# Altium schematic sheet led-driver.SchDoc
size A
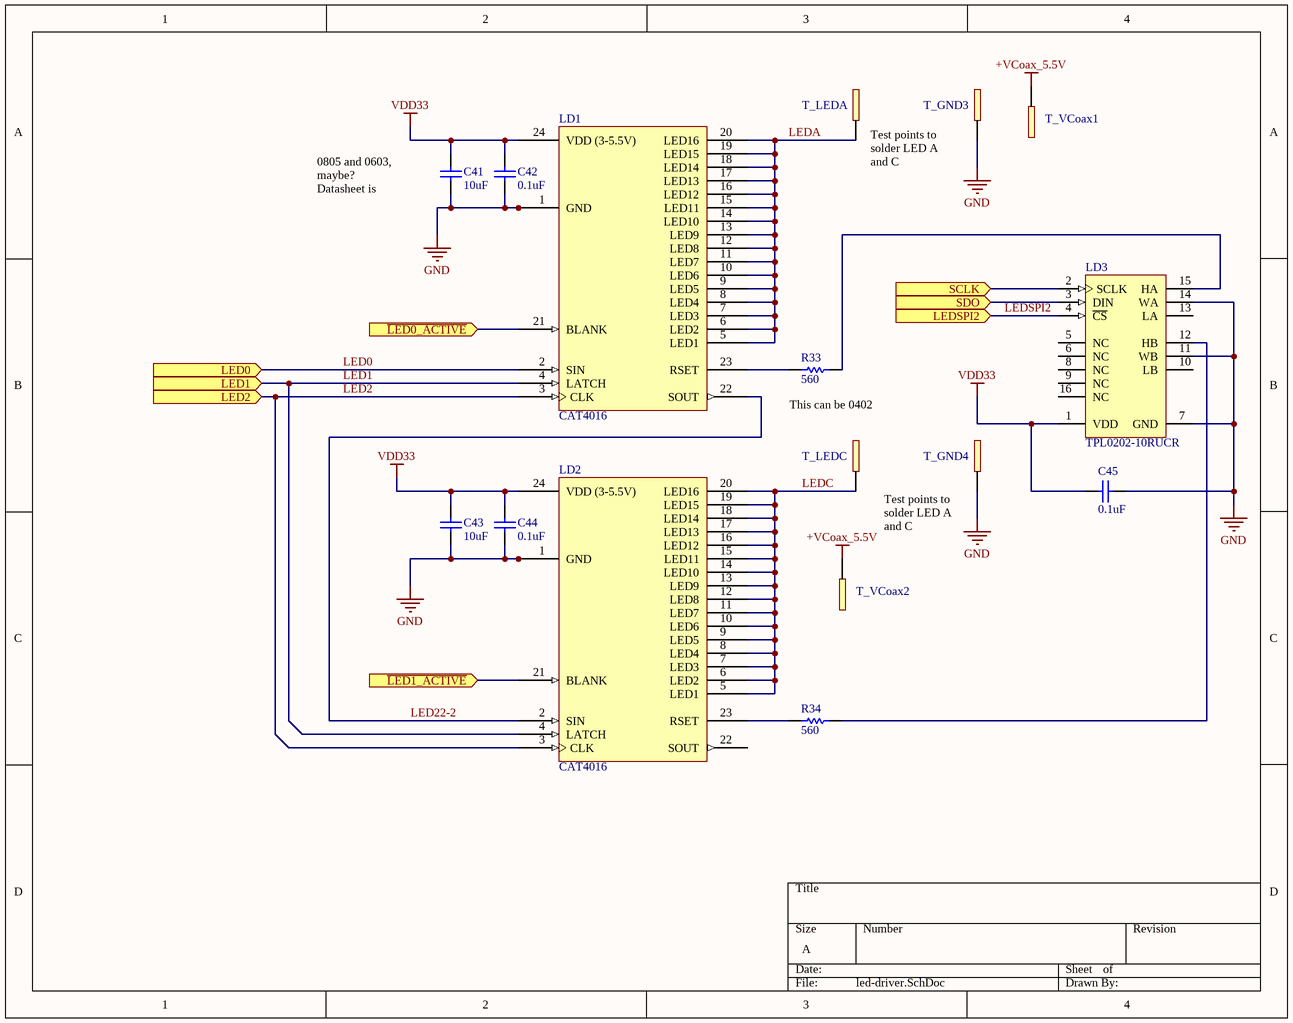
[diagram p0: led-driver.SchDoc]

## Parts
C41  value 10uF  [Cap-0603]  (hidden comment: Cap)
C42  value 0.1uF  [Cap_0402]  (hidden comment: Cap)
C43  value 10uF  [Cap-0603]  (hidden comment: Cap)
C44  value 0.1uF  [Cap_0402]  (hidden comment: Cap)
C45  value 0.1uF  [Cap_0402]  (hidden comment: Cap)
LD1  CAT4016  [TQFN24-4x4mm]
LD2  CAT4016  [TQFN24-4x4mm]
LD3  TPL0202-10RUCR  [WQFN16-3X3mm]
R33  value 560  [Res_0402]  (hidden comment: Res1)
R34  value 560  [Res_0402]  (hidden comment: Res1)
T_GND3  Header_1PIN  [JUMPER1PIN]  (value not drawn)
T_GND4  Header_1PIN  [JUMPER1PIN]  (value not drawn)
T_LEDA  Header_1PIN  [JUMPER1PIN]  (value not drawn)
T_LEDC  Header_1PIN  [JUMPER1PIN]  (value not drawn)
T_VCoax1  Header_1PIN  [JUMPER1PIN]  (value not drawn)
T_VCoax2  Header_1PIN  [JUMPER1PIN]  (value not drawn)

## Ports
LED0 (in), LED1 (in), LED2 (in), LEDSPI2 (in), SCLK (in), SDO (in), ~{LED0_ACTIVE} (in), ~{LED1_ACTIVE} (in)

## Nets
+VCoax_5.5V: T_VCoax1.0 T_VCoax2.0
GND: C41.1 C42.1 C43.1 C44.1 C45.2 LD1.1(GND) LD1.PAD LD2.1(GND) LD2.PAD LD3.7(GND) LD3.11(WB) LD3.14(WA) T_GND3.0 T_GND4.0
VDD33: C41.2 C42.2 C43.2 C44.2 C45.1 LD1.24(VDD_(3-5.5V)) LD2.24(VDD_(3-5.5V)) LD3.1(VDD)
~{LED0_ACTIVE}: LD1.21(BLANK) ; port ~{LED0_ACTIVE}
~{LED1_ACTIVE}: LD2.21(BLANK) ; port ~{LED1_ACTIVE}
LED0: LD1.2(SIN) ; port LED0
LED1: LD1.4(LATCH) LD2.4(LATCH) ; port LED1
LED2: LD1.3(CLK) LD2.3(CLK) ; port LED2
LED22-2: LD1.22(SOUT) LD2.2(SIN)
LEDA: LD1.5(LED1) LD1.6(LED2) LD1.7(LED3) LD1.8(LED4) LD1.9(LED5) LD1.10(LED6) LD1.11(LED7) LD1.12(LED8) LD1.13(LED9) LD1.14(LED10) LD1.15(LED11) LD1.16(LED12) LD1.17(LED13) LD1.18(LED14) LD1.19(LED15) LD1.20(LED16) T_LEDA.0
LEDC: LD2.5(LED1) LD2.6(LED2) LD2.7(LED3) LD2.8(LED4) LD2.9(LED5) LD2.10(LED6) LD2.11(LED7) LD2.12(LED8) LD2.13(LED9) LD2.14(LED10) LD2.15(LED11) LD2.16(LED12) LD2.17(LED13) LD2.18(LED14) LD2.19(LED15) LD2.20(LED16) T_LEDC.0
LEDSPI2: LD3.4(~{CS}) ; port LEDSPI2
SCLK: LD3.2(SCLK) ; port SCLK
SDO: LD3.3(DIN) ; port SDO
NetLD1_23: LD1.23(RSET) R33.2
NetLD2_23: LD2.23(RSET) R34.2
NetLD3_12: LD3.12(HB) R34.1
NetLD3_15: LD3.15(HA) R33.1

Not connected (* = marked no-connect by the designer): LD2 22(SOUT); LD3 5(NC) 6(NC) 8(NC) 9(NC) 10(LB) 13(LA) 16(NC)

## Notes on the sheet
- Test points to solder LED A and C
- (near C41) 0805 and 0603, maybe? Datasheet is lacking...
- (near R33) This can be 0402

## Library data of the parts
C41-C45 = Cap: Capacitor; Published: 8-Jun-2000; LatestRevisionDate: 17-Jul-2002; LatestRevisionNote: Re-released for DXP Platform.; PackageReference: RAD-0.3; Publisher: Altium Limited; PackageDescription: Radial Cap, Thru-Hole; 2 Leads; 0.3 in Pin Spacing
LD1 LD2 = CAT4016: 16-Channel Constant Current LED Driver
LD3 = TPL0202-10RUCR: 256 Tap, Dual Channel Digital Potentiometer with SPI Interface and Non-Volatile Memory, -40 to 85 degC, 14-pin QFN (RUC14); Manufacturer: Texas Instruments; DAC Channels: 2; DNL(Max)(+/-LSB): 0.5; INL(Max)(+/-LSB): 1; DatasheetVersion: SLIS135C; PackageVersion: 4208447/C, 08/2008; PackageReference: RUC14; PackageDescription: 14-Pin Plastic Quad Flatpack No-Lead, Body 2 x 2 mm, Pitch 0.4 mm; Supplier 1: Mouser; Supplier Part Number 1: N/A; Interface: SPI; SubFamily: Digital Potentiometer; Mounting Technology: Surface Mount; Code_JEDEC: MO-288; PartNumber: TPL0202-10RUCR; ComponentLink1Description: Manufacturer URL; ComponentLink1URL: http://www.ti.com/; ComponentLink2Description: Datasheet; ComponentLink2URL: http://www.ti.com/general/docs/lit/getliterature.tsp?genericPartNumber=TPL0202-10&fileType=pdf; ComponentLink3Description: Package Specification; ComponentLink3URL: http://www.ti.com/lit/ml/mpqf212b/mpqf212b.pdf
R33 R34 = Res1: Resistor; Published: 8-Jun-2000; LatestRevisionDate: 17-Jul-2002; LatestRevisionNote: Re-released for DXP Platform.; PackageReference: AXIAL-0.3; Publisher: Altium Limited; PackageDescription: Axial Device, Thru-Hole; 2 Leads; 0.3 in Pin Spacing